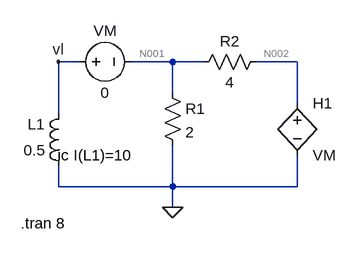
[diagram p0: schematic sadiku_chapter7_example_7_withDependent_Source.asc]
sadiku_chapter7_example_7_withDependent_Source.asc, the LTspice schematic file:
Version 4
SHEET 1 880 680
WIRE 48 80 16 80
WIRE 192 80 128 80
WIRE 240 80 192 80
WIRE 384 80 320 80
WIRE 192 128 192 80
WIRE 384 144 384 80
WIRE 16 160 16 80
WIRE 16 272 16 240
WIRE 192 272 192 208
WIRE 192 272 16 272
WIRE 384 272 384 224
WIRE 384 272 192 272
WIRE 192 304 192 272
FLAG 192 304 0
FLAG 16 80 vl
SYMBOL ind 32 256 R180
WINDOW 0 36 80 Left 2
WINDOW 3 36 40 Left 2
SYMATTR InstName L1
SYMATTR Value 0.5
SYMBOL h 384 128 R0
SYMATTR InstName H1
SYMATTR Value VM
SYMATTR Value2 3
SYMBOL res 176 112 R0
SYMATTR InstName R1
SYMATTR Value 2
SYMBOL res 224 96 R270
WINDOW 0 32 56 VTop 2
WINDOW 3 0 56 VBottom 2
SYMATTR InstName R2
SYMATTR Value 4
SYMBOL voltage 32 80 R270
WINDOW 0 32 56 VTop 2
WINDOW 3 -32 56 VBottom 2
WINDOW 123 0 0 Left 0
WINDOW 39 0 0 Left 0
SYMATTR InstName VM
SYMATTR Value 0
TEXT 8 224 Left 2 !.ic I(L1)=10
TEXT -42 328 Left 2 !.tran 8

The netlist it stands for:
* sadiku_chapter7_example_7_withDependent_Source.asc
L1 0 vl 0.5
H1 N002 0 VM 3
R1 N001 0 2
R2 N001 N002 4
VM vl N001 0
.ic I(L1)=10
.tran 8
.backanno
.end

* Results of the author's LTspice run, read from the files saved beside the schematic
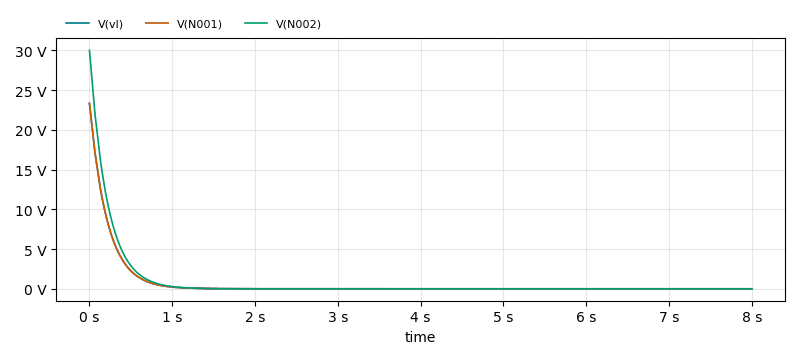
[diagram p1: Transient Analysis of sadiku_chapter7_example_7_withDependent_Source.asc, plotted from the saved traces]
* Transient Analysis, 1 run:
*   V(vl): min 0 V, max 23.33 V, average 627.3 mV, rms 2.732 V, last 0 V
*   V(N001): min 0 V, max 23.33 V, average 627.3 mV, rms 2.732 V, last 0 V
*   V(N002): min 0 V, max 30 V, average 806.8 mV, rms 3.513 V, last 0 V